# EAGLE schematic Vocodec_rev2_2 (EAGLE 6.5.0)
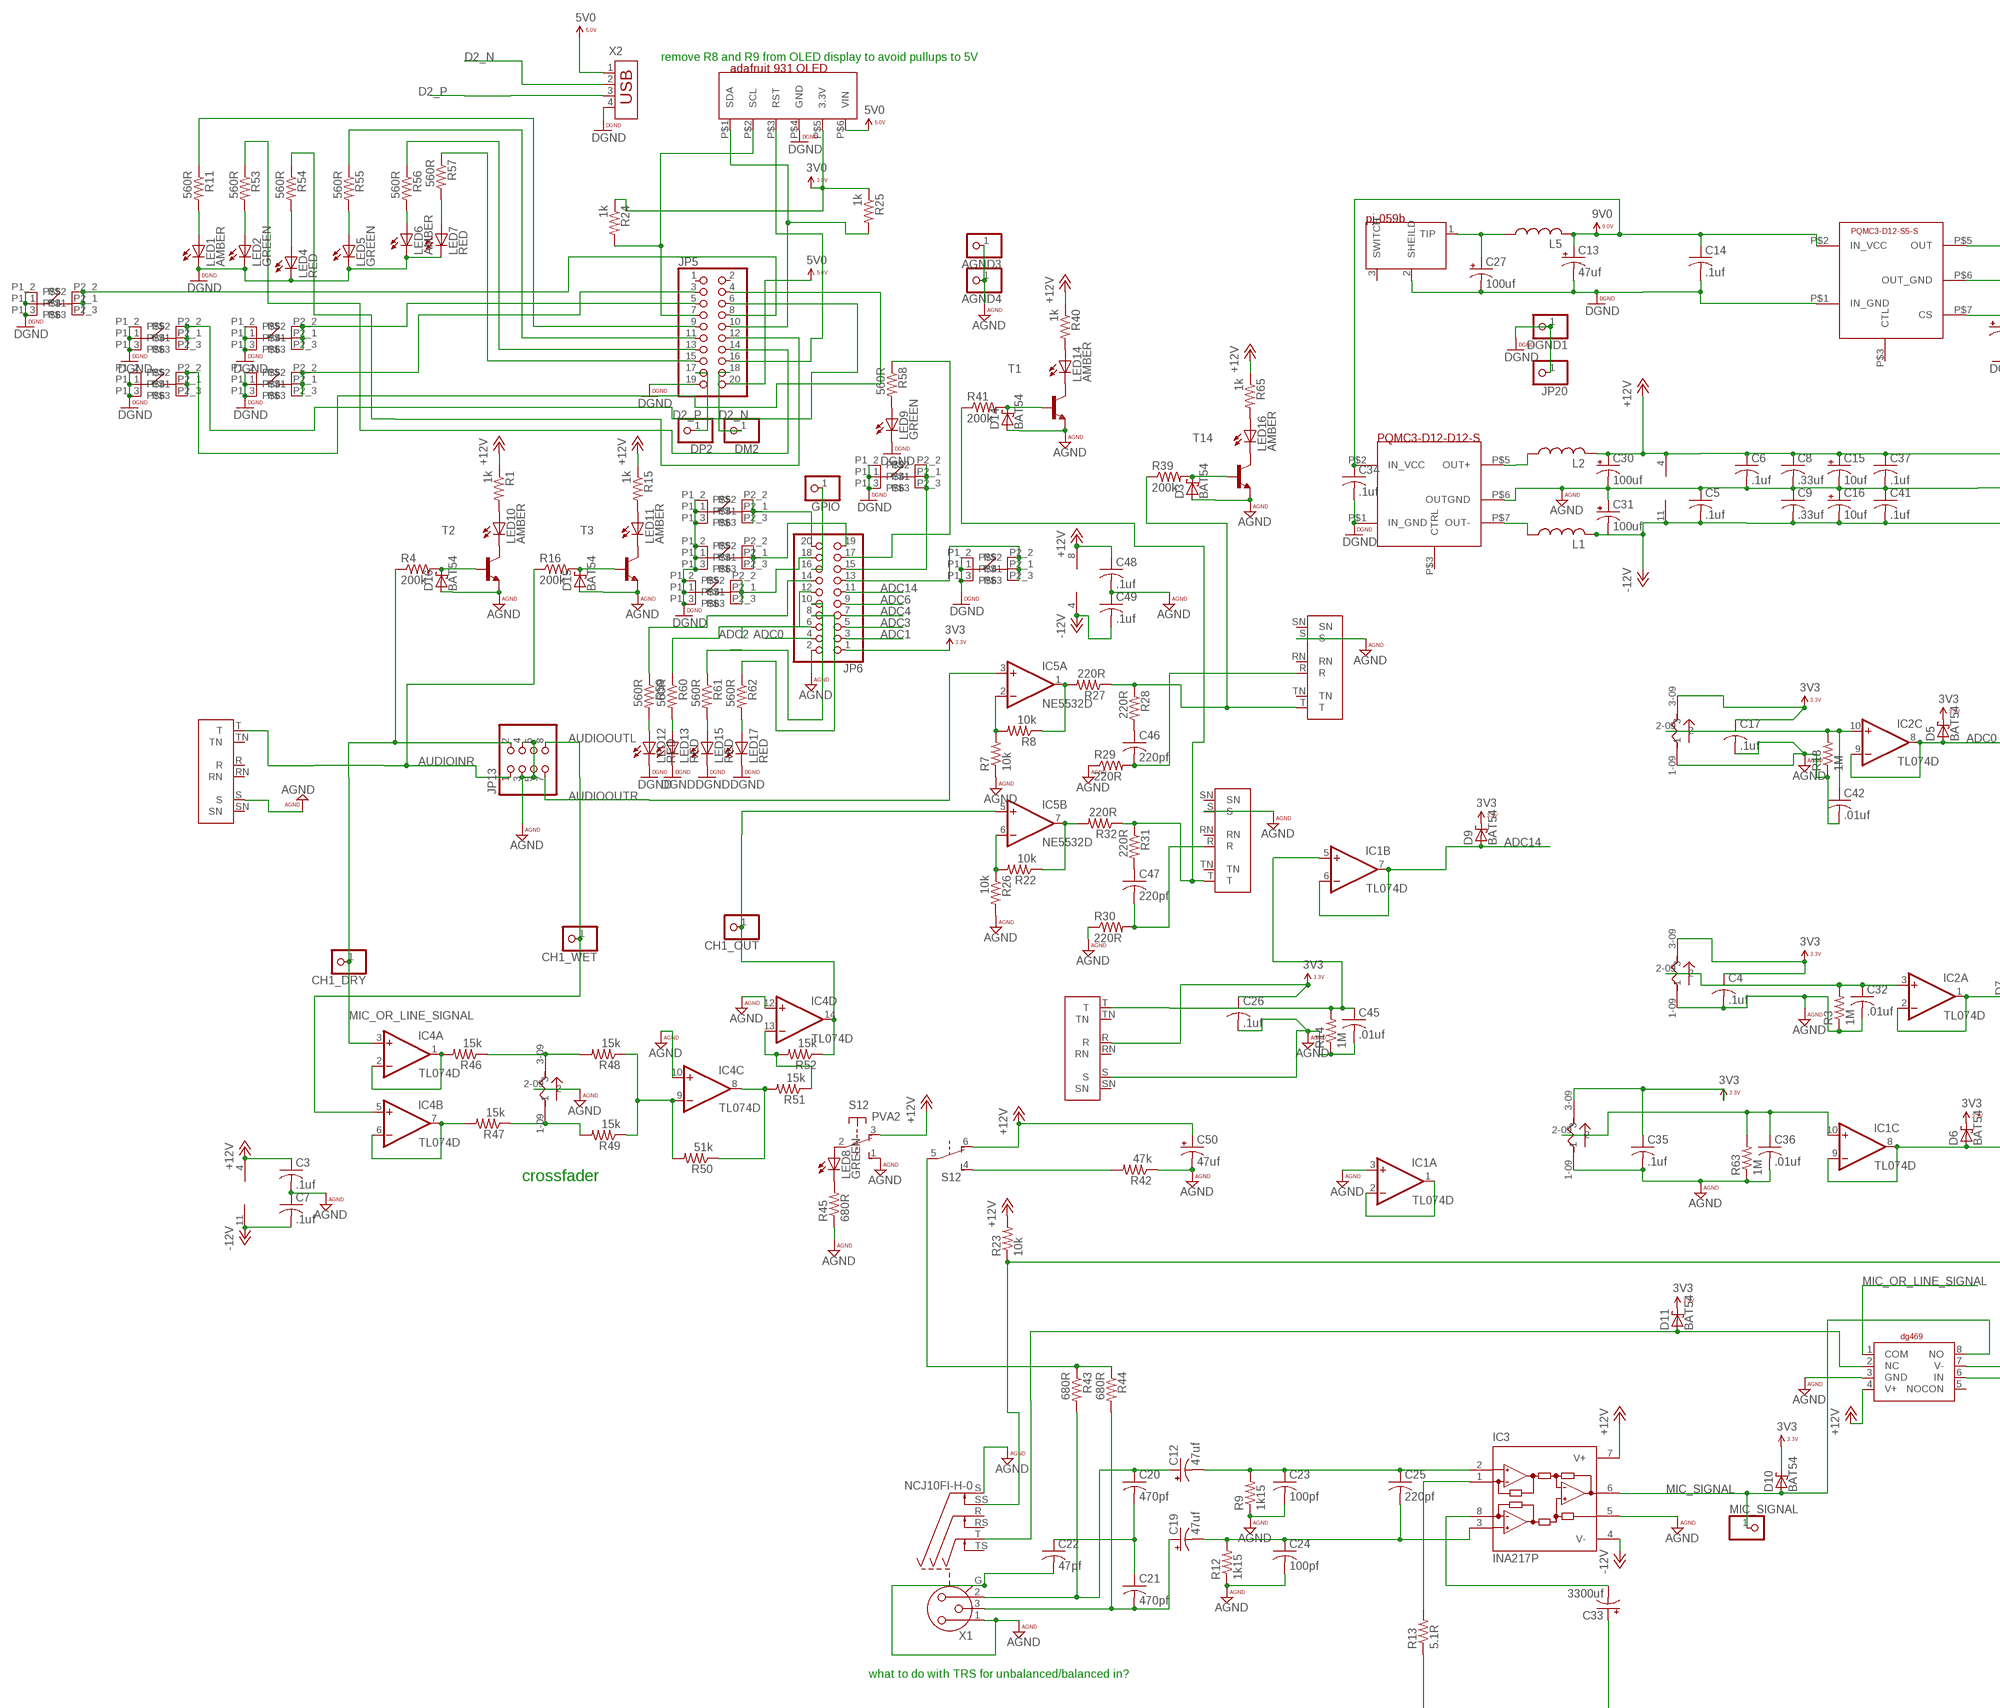
[diagram p0: schematic, sheet 1, part 1 of 3]
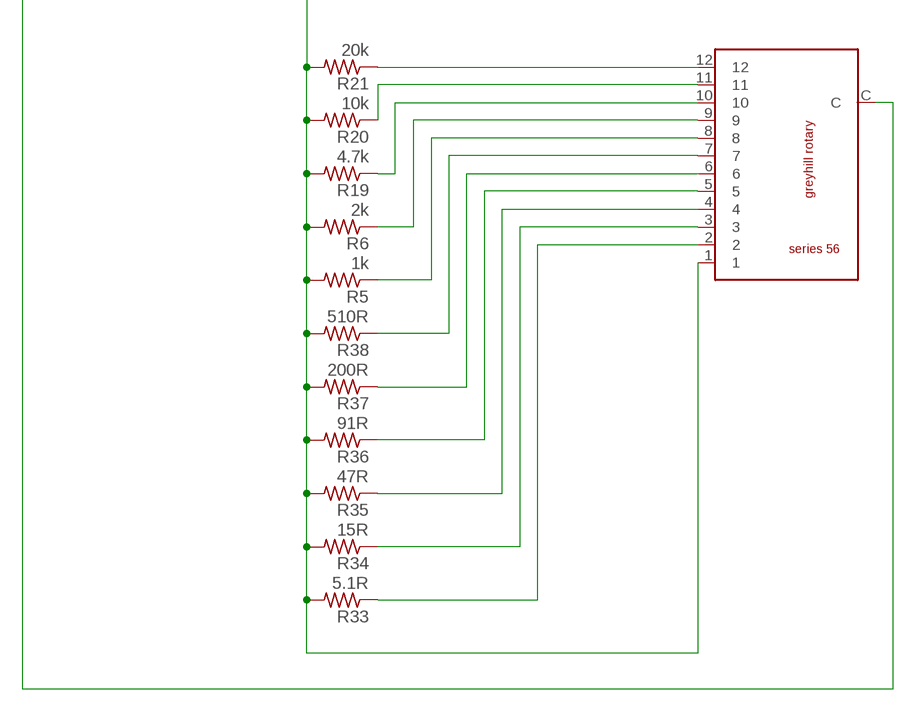
[diagram p1: schematic, sheet 1, part 2 of 3]
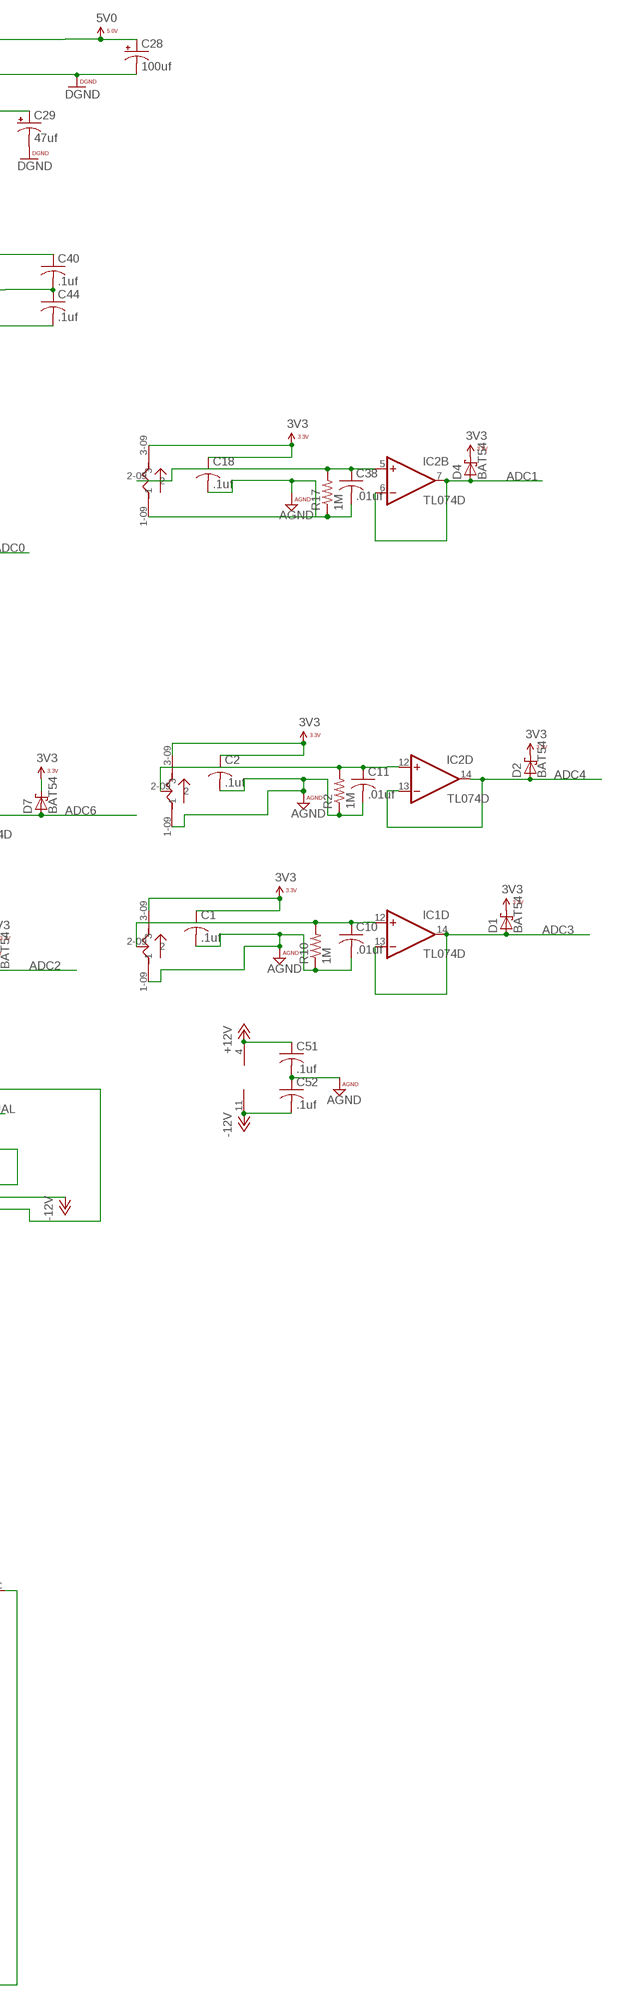
[diagram p2: schematic, sheet 1, part 3 of 3]

## Parts
AGND3  PINHD-1X1  [1X01]
AGND4  PINHD-1X1  [1X01]
C1  .1uf  C-USC0603  [C0603]
C2  .1uf  C-USC0603  [C0603]
C3  .1uf  C-USC0603  [C0603]
C4  .1uf  C-USC0603  [C0603]
C5  .1uf  C-USC0603  [C0603]
C6  .1uf  C-USC0603  [C0603]
C7  .1uf  C-USC0603  [C0603]
C8  .33uf  C-USC0603  [C0603]
C9  .33uf  C-USC0603  [C0603]
C10  .01uf  C-USC0603  [C0603]
C11  .01uf  C-USC0603  [C0603]
C12  47uf  CPOL-USE  [PANASONIC_E]
C13  47uf  CPOL-USE  [PANASONIC_E]
C14  .1uf  C-USC0603  [C0603]
C15  10uf  CPOL-USC  [PANASONIC_C]
C16  10uf  CPOL-USC  [PANASONIC_C]
C17  .1uf  C-USC0603  [C0603]
C18  .1uf  C-USC0603  [C0603]
C19  47uf  CPOL-USE  [PANASONIC_E]
C20  470pf  C-USC0603  [C0603]
C21  470pf  C-USC0603  [C0603]
C22  47pf  C-USC0603  [C0603]
C23  100pf  C-USC0603  [C0603]
C24  100pf  C-USC0603  [C0603]
C25  220pf  C-USC0603  [C0603]
C26  .1uf  C-USC0603  [C0603]
C27  100uf  CPOL-USF  [PANASONIC_F]
C28  100uf  CPOL-USF  [PANASONIC_F]
C29  47uf  CPOL-USE  [PANASONIC_E]
C30  100uf  CPOL-USF  [PANASONIC_F]
C31  100uf  CPOL-USF  [PANASONIC_F]
C32  .01uf  C-USC0603  [C0603]
C33  3300uf  CPOL-USE5-13  [E5-13]
C34  .1uf  C-USC0603  [C0603]
C35  .1uf  C-USC0603  [C0603]
C36  .01uf  C-USC0603  [C0603]
C37  .1uf  C-USC0603  [C0603]
C38  .01uf  C-USC0603  [C0603]
C40  .1uf  C-USC0603  [C0603]
C41  .1uf  C-USC0603  [C0603]
C42  .01uf  C-USC0603  [C0603]
C44  .1uf  C-USC0603  [C0603]
C45  .01uf  C-USC0603  [C0603]
C46  220pf  C-USC0603  [C0603]
C47  220pf  C-USC0603  [C0603]
C48  .1uf  C-USC0603  [C0603]
C49  .1uf  C-USC0603  [C0603]
C50  47uf  CPOL-USE  [PANASONIC_E]
C51  .1uf  C-USC0603  [C0603]
C52  .1uf  C-USC0603  [C0603]
CH1_DRY  PINHD-1X1  [1X01]
CH1_OUT  PINHD-1X1  [1X01]
CH1_WET  PINHD-1X1  [1X01]
D1  BAT54  [SOT23]
D2  BAT54  [SOT23]
D3  BAT54  [SOT23]
D4  BAT54  [SOT23]
D5  BAT54  [SOT23]
D6  BAT54  [SOT23]
D7  BAT54  [SOT23]
D9  BAT54  [SOT23]
D10  BAT54  [SOT23]
D11  BAT54  [SOT23]
D14  BAT54  [SOT23]
D15  BAT54  [SOT23]
D16  BAT54  [SOT23]
DGND1  PINHD-1X1  [1X01]
DM2  PINHD-1X1  [1X01]
DP2  PINHD-1X1  [1X01]
GPIO  PINHD-1X1  [1X01]
IC1  TL074D  [SO14]
IC2  TL074D  [SO14]
IC3  INA217P  [DIL08]
IC4  TL074D  [SO14]
IC5  NE5532D  [SO08]
IC11  PQMC3-D12-D12-S  [PQMC3-D12-D12-S]
IC12  PQMC3-D12-S5-S  [PQMC3-D12-D12-S]
IC13  DG469  [SO8]
J1  NRJ6HF2  [NRJ6HF2]
J3  NRJ6HF2  [NRJ6HF2]
J4  NRJ6HF2  [NRJ6HF2]
J9  NRJ6HF2  [NRJ6HF2]
J10  PJ-059B  [PJ-059B]
JP5  PINHD-2X10  [2X10]
JP6  PINHD-2X10  [2X10]
JP13  PINHD-2X4  [2X04]
JP20  PINHD-1X1  [1X01]
L1  L-US6000-XXX-RC  [6000-XXXX-RC]
L2  L-US6000-XXX-RC  [6000-XXXX-RC]
L5  L-US6000-XXX-RC  [6000-XXXX-RC]
LED1  AMBER  LG_T679-E1F1-1  [PLCC2]
LED2  GREEN  LG_T679-E1F1-1  [PLCC2]
LED4  RED  LG_T679-E1F1-1  [PLCC2]
LED5  GREEN  LG_T679-E1F1-1  [PLCC2]
LED6  AMBER  LG_T679-E1F1-1  [PLCC2]
LED7  RED  LG_T679-E1F1-1  [PLCC2]
LED8  GREEN  LG_T679-E1F1-1  [PLCC2]
LED9  GREEN  LG_T679-E1F1-1  [PLCC2]
LED10  AMBER  LG_T679-E1F1-1  [PLCC2]
LED11  AMBER  LG_T679-E1F1-1  [PLCC2]
LED12  RED  LG_T679-E1F1-1  [PLCC2]
LED13  RED  LG_T679-E1F1-1  [PLCC2]
LED14  AMBER  LG_T679-E1F1-1  [PLCC2]
LED15  RED  LG_T679-E1F1-1  [PLCC2]
LED16  AMBER  LG_T679-E1F1-1  [PLCC2]
LED17  RED  LG_T679-E1F1-1  [PLCC2]
MIC_SIGNAL  PINHD-1X1  [1X01]
OLED1  ADAFRUIT_931_OLED_128X32  [ADAFRUIT_128X32_OLED]
R1  1k  R-US_R0603  [R0603]
R2  1M  R-US_R0603  [R0603]
R3  1M  R-US_R0603  [R0603]
R4  200k  R-US_R0603  [R0603]
R5  1k  R-US_R0603  [R0603]
R6  2k  R-US_R0603  [R0603]
R7  10k  R-US_R0603  [R0603]
R8  10k  R-US_R0603  [R0603]
R9  1k15  R-US_R0603  [R0603]
R10  1M  R-US_R0603  [R0603]
R11  560R  R-US_R0603  [R0603]
R12  1k15  R-US_R0603  [R0603]
R13  5.1R  R-US_R0603  [R0603]
R14  1M  R-US_R0603  [R0603]
R15  1k  R-US_R0603  [R0603]
R16  200k  R-US_R0603  [R0603]
R17  1M  R-US_R0603  [R0603]
R18  1M  R-US_R0603  [R0603]
R19  4.7k  R-US_R0603  [R0603]
R20  10k  R-US_R0603  [R0603]
R21  20k  R-US_R0603  [R0603]
R22  10k  R-US_R0603  [R0603]
R23  10k  R-US_R0603  [R0603]
R24  1k  R-US_R0603  [R0603]
R25  1k  R-US_R0603  [R0603]
R26  10k  R-US_R0603  [R0603]
R27  220R  R-US_R0603  [R0603]
R28  220R  R-US_R0603  [R0603]
R29  220R  R-US_R0603  [R0603]
R30  220R  R-US_R0603  [R0603]
R31  220R  R-US_R0603  [R0603]
R32  220R  R-US_R0603  [R0603]
R33  5.1R  R-US_R0603  [R0603]
R34  15R  R-US_R0603  [R0603]
R35  47R  R-US_R0603  [R0603]
R36  91R  R-US_R0603  [R0603]
R37  200R  R-US_R0603  [R0603]
R38  510R  R-US_R0603  [R0603]
R39  200k  R-US_R0603  [R0603]
R40  1k  R-US_R0603  [R0603]
R41  200k  R-US_R0603  [R0603]
R42  47k  R-US_R0603  [R0603]
R43  680R  R-US_R0603  [R0603]
R44  680R  R-US_R0603  [R0603]
R45  680R  R-US_R0603  [R0603]
R46  15k  R-US_R0603  [R0603]
R47  15k  R-US_R0603  [R0603]
R48  15k  R-US_R0603  [R0603]
R49  15k  R-US_R0603  [R0603]
R50  51k  R-US_R0603  [R0603]
R51  15k  R-US_R0603  [R0603]
R52  15k  R-US_R0603  [R0603]
R53  560R  R-US_R0603  [R0603]
R54  560R  R-US_R0603  [R0603]
R55  560R  R-US_R0603  [R0603]
R56  560R  R-US_R0603  [R0603]
R57  560R  R-US_R0603  [R0603]
R58  560R  R-US_R0603  [R0603]
R59  560R  R-US_R0603  [R0603]
R60  560R  R-US_R0603  [R0603]
R61  560R  R-US_R0603  [R0603]
R62  560R  R-US_R0603  [R0603]
R63  1M  R-US_R0603  [R0603]
R65  1k  R-US_R0603  [R0603]
S12  PVA2  [PVA2F]
T1  MMBT3904LT1-NPN-SOT23-BEC  [SOT23-BEC]
T2  MMBT3904LT1-NPN-SOT23-BEC  [SOT23-BEC]
T3  MMBT3904LT1-NPN-SOT23-BEC  [SOT23-BEC]
T14  MMBT3904LT1-NPN-SOT23-BEC  [SOT23-BEC]
U$1  56DP30  [56DP30]
U$7  TL52_PLUS  [TL52_PLUS]
U$11  TL52_PLUS  [TL52_PLUS]
U$12  RK09  [RK09]
U$14  RK09  [RK09]
U$16  RK09  [RK09]
U$27  RK09  [RK09]
U$28  RK09  [RK09]
U$31  RK09  [RK09]
U$32  RK09  [RK09]
U$33  TL52_PLUS  [TL52_PLUS]
U$39  TL52_PLUS  [TL52_PLUS]
U$40  TL52_PLUS  [TL52_PLUS]
U$42  TL52_PLUS  [TL52_PLUS]
U$43  TL52_PLUS  [TL52_PLUS]
U$44  TL52_PLUS  [TL52_PLUS]
U$45  TL52_PLUS  [TL52_PLUS]
U$48  TL52_PLUS  [TL52_PLUS]
X1  NCJ10FI-H-0  [NCJ10FI-H-0]
X2  USB-787616  [USB]

## Nets
3V0: OLED1.P$5(3.3V) R24.1 R25.1
3V3: C1.1 C2.1 C4.1 C17.1 C18.1 C26.1 C35.1 D1.3(C) D2.3(C) D4.3(C) D5.3(C) D6.3(C) D7.3(C) D9.3(C) D10.3(C) D11.3(C) J9.R JP6.1 U$12.3-09 U$16.3-09 U$27.3-09 U$28.3-09 U$31.3-09 U$32.3-09
5V0: C28.+ IC12.P$5(OUT) JP5.20 OLED1.P$6(VIN) X2.1
9V0: C13.+ C14.1 C34.1 IC11.P$2(IN_VCC) IC12.P$2(IN_VCC) L5.2
+12V: C3.1 C6.1 C8.1 C15.+ C30.+ C37.1 C40.1 C48.1 C50.+ C51.1 IC1.4(P:V+) IC2.4(P:V+) IC3.7(V+) IC4.4(P:V+) IC5.8(P:V+) IC13.4(V+) L2.2 R1.1 R15.1 R23.2 R40.1 R65.1 S12.3(1:O) S12.6(2:O)
-12V: C5.2 C7.2 C9.2 C16.- C31.- C41.2 C44.2 C49.2 C52.2 IC1.11(P:V-) IC2.11(P:V-) IC3.4(V-) IC4.11(P:V-) IC5.4(P:V-) IC13.7(V-) L1.2
ADC0: D5.1(A) IC2.8(C:OUT) IC2.9(C:-IN) JP6.4
ADC1: D4.1(A) IC2.6(B:-IN) IC2.7(B:OUT) JP6.3
ADC2: D6.1(A) IC1.8(C:OUT) IC1.9(C:-IN) JP6.6
ADC3: D1.1(A) IC1.13(D:-IN) IC1.14(D:OUT) JP6.5
ADC4: D2.1(A) IC2.13(D:-IN) IC2.14(D:OUT) JP6.7
ADC6: D7.1(A) IC2.1(A:OUT) IC2.2(A:-IN) JP6.9
ADC14: D9.1(A) IC1.6(B:-IN) IC1.7(B:OUT) JP6.11
AGND: AGND3.1 AGND4.1 C1.2 C2.2 C3.2 C4.2 C5.1 C6.2 C7.1 C8.2 C9.1 C10.2 C11.2 C15.- C16.+ C17.2 C18.2 C22.2 C23.2 C24.2 C26.2 C30.- C31.+ C32.2 C35.2 C36.2 C37.2 C38.2 C40.2 C41.1 C42.2 C44.1 C45.2 C48.2 C49.1 C50.- C51.2 C52.1 D3.1(A) D14.1(A) D15.1(A) D16.1(A) IC1.3(A:+IN) IC3.5(REF) IC4.10(C:+IN) IC4.12(D:+IN) IC11.P$6(OUTGND) IC13.3(GND) J1.S J3.S J4.S J9.S JP6.2 JP13.3 JP13.4 JP13.5 JP13.6 R2.1 R3.1 R7.1 R9.1 R10.1 R12.1 R14.1 R17.1 R18.1 R26.2 R29.1 R30.1 R42.1 R45.1 R63.1 S12.1(1:S) T1.E T2.E T3.E T14.E U$12.1-09 U$14.2-09 U$16.1-09 U$27.1-09 U$28.1-09 U$31.1-09 U$32.1-09 X1.1 X1.G X1.S
AUDIOINR: J1.T JP13.1 R16.1
AUDIOOUTL: CH1_WET.1 IC4.5(B:+IN) JP13.8
AUDIOOUTR: IC5.3(A:+IN) JP13.7
D2_N: DM2.1 JP5.18 X2.2
D2_P: DP2.1 JP5.17 X2.3
DGND: C13.- C14.2 C27.- C28.- C29.- C34.2 DGND1.1 IC11.P$1(IN_GND) IC12.P$1(IN_GND) IC12.P$6(OUT_GND) J10.2(SHEILD) JP5.19 JP20.1 LED1.C LED2.C LED4.C LED5.C LED6.C LED7.C LED9.C LED12.C LED13.C LED15.C LED17.C OLED1.P$4(GND) U$7.P1_1 U$7.P1_2 U$7.P1_3 U$11.P1_1 U$11.P1_2 U$11.P1_3 U$33.P1_1 U$33.P1_2 U$33.P1_3 U$39.P1_1 U$39.P1_2 U$39.P1_3 U$40.P1_1 U$40.P1_2 U$40.P1_3 U$42.P1_1 U$42.P1_2 U$42.P1_3 U$43.P1_1 U$43.P1_2 U$43.P1_3 U$44.P1_1 U$44.P1_2 U$44.P1_3 U$45.P1_1 U$45.P1_2 U$45.P1_3 U$48.P1_1 U$48.P1_2 U$48.P1_3 X2.4
MIC_OR_LINE_SIGNAL: CH1_DRY.1 IC4.3(A:+IN) IC13.1(COM) JP13.2 R4.1
MIC_SIGNAL: D10.1(A) IC3.6(OUT) IC13.8(NO) MIC_SIGNAL.1
N$1: IC5.2(A:-IN) R7.2 R8.2
N$2: IC5.6(B:-IN) R22.2 R26.1
N$3: LED10.C T2.C
N$4: IC5.1(A:OUT) R8.1 R27.2
N$5: LED10.A R1.2
N$6: IC1.1(A:OUT) IC1.2(A:-IN)
N$7: LED11.C T3.C
N$8: D16.3(C) R4.2 T2.B
N$9: IC5.7(B:OUT) R22.1 R32.2
N$10: IC13.6(IN) R23.1 X1.SS
N$11: LED11.A R15.2
N$12: C33.+ R5.2 R6.2 R19.2 R20.2 R21.2 R33.2 R34.2 R35.2 R36.2 R37.2 R38.2 U$1.1
N$13: D15.3(C) R16.2 T3.B
N$14: IC11.P$5(OUT+) L2.1
N$15: IC11.P$7(OUT-) L1.1
N$16: LED14.C T1.C
N$17: LED14.A R40.2
N$18: JP6.19 U$45.P2_1 U$45.P2_2 U$45.P2_3
N$19: R21.1 U$1.12
N$20: R20.1 U$1.11
N$21: C12.- C23.1 C25.1 IC3.2(-IN) R9.2
N$22: C19.+ C21.2 R44.2 X1.3
N$23: C12.+ C20.1 R43.2 X1.2
N$24: C20.2 C21.1 C22.1
N$25: LED16.C T14.C
N$26: LED16.A R65.2
N$27: R19.1 U$1.10
N$28: R6.1 U$1.9
N$29: C19.- C24.1 C25.2 IC3.3(+IN) R12.2
N$30: LED8.A S12.2(1:P)
N$31: IC3.1(RG1) R13.2
N$32: D11.1(A) IC13.2(NC) X1.T
N$33: R5.1 U$1.8
N$34: R38.1 U$1.7
N$35: R13.1 U$1.C
N$36: R37.1 U$1.6
N$37: R36.1 U$1.5
N$38: R35.1 U$1.4
N$39: R34.1 U$1.3
N$40: R33.1 U$1.2
N$41: J3.T R27.1 R28.1 R39.1
N$42: C46.2 J3.R R29.2
N$43: R42.2 S12.4(2:S)
N$44: C47.2 J4.R R30.2
N$45: D3.3(C) R39.2 T14.B
N$46: C46.1 R28.2
N$47: C47.1 R31.2
N$48: J4.T R31.1 R32.1 R41.1
N$49: LED8.C R45.2
N$50: C27.+ J10.1(TIP) L5.1
N$51: IC4.1(A:OUT) IC4.2(A:-IN) R46.2
N$52: D14.3(C) R41.2 T1.B
N$53: C29.+ IC12.P$7(CS)
N$54: R43.1 R44.1 S12.5(2:P)
N$55: IC4.6(B:-IN) IC4.7(B:OUT) R47.2
N$56: R46.1 R48.2 U$14.3-09
N$57: C36.1 IC1.10(C:+IN) R63.2 U$16.2-09
N$58: IC4.8(C:OUT) R50.1 R51.2
N$59: IC4.9(C:-IN) R48.1 R49.1 R50.2
N$60: IC4.13(D:-IN) R51.1 R52.2
N$62: LED1.A R11.2
N$63: LED2.A R53.2
N$64: CH1_OUT.1 IC4.14(D:OUT) IC5.5(B:+IN) R52.1
N$65: LED4.A R54.2
N$66: LED5.A R55.2
N$67: JP6.18 U$48.P2_1 U$48.P2_2 U$48.P2_3
N$68: C33.- IC3.8(RG2)
N$69: LED9.A R58.2
N$70: JP6.17 R58.1
N$71: LED6.A R56.2
N$72: LED7.A R57.2
N$73: JP6.15 U$43.P2_1 U$43.P2_2 U$43.P2_3
N$74: JP6.13 U$42.P2_1 U$42.P2_2 U$42.P2_3
N$75: LED12.A R59.2
N$76: LED13.A R60.2
N$77: JP6.20 U$44.P2_1 U$44.P2_2 U$44.P2_3
N$78: LED15.A R61.2
N$79: LED17.A R62.2
N$80: JP6.14 R59.1
N$81: JP6.12 R60.1
N$82: JP6.10 R61.1
N$83: JP6.8 R62.1
N$84: GPIO.1 JP6.16
N$85: R47.1 R49.2 U$14.1-09
PA8: JP5.13 R56.1
PA9: JP5.16 OLED1.P$3(RST)
PA10: JP5.15 R57.1
PB12: JP5.4 U$39.P2_1 U$39.P2_2 U$39.P2_3
PB13: JP5.3 U$7.P2_1 U$7.P2_2 U$7.P2_3
PB14: JP5.6 U$33.P2_1 U$33.P2_2 U$33.P2_3
PB15: JP5.5 U$11.P2_1 U$11.P2_2 U$11.P2_3
PC6: JP5.9 R11.1
PC7: JP5.12 R54.1
PC8: JP5.11 R55.1
PC9: JP5.14 R53.1
PD11_NOTIMER: JP5.8 U$40.P2_1 U$40.P2_2 U$40.P2_3
POT1: C10.1 IC1.12(D:+IN) R10.2 U$12.2-09
POT3: C32.1 IC2.3(A:+IN) R3.2 U$32.2-09
POT4: C11.1 IC2.12(D:+IN) R2.2 U$31.2-09
POT7: C38.1 IC2.5(B:+IN) R17.2 U$28.2-09
POT8: C42.1 IC2.10(C:+IN) R18.2 U$27.2-09
POT9: C45.1 IC1.5(B:+IN) J9.T R14.2
SCL: JP5.7 OLED1.P$2(SCL) R24.2
SDA: JP5.10 OLED1.P$1(SDA) R25.2
Unconnected: IC11.P$3(CTRL) IC12.P$3(CTL) IC13.5(NOCON) J1.R J1.RN J1.SN J1.TN J3.RN J3.SN J3.TN J4.RN J4.SN J4.TN J9.RN J9.SN J9.TN J10.3(SWITCH) JP5.1 JP5.2 X1.R X1.RS X1.TS

## Notes on the sheet
- remove R8 and R9 from OLED display to avoid pullups to 5V
- crossfader
- what to do with TRS for unbalanced/balanced in?

## Library data of the parts
AGND3 AGND4 CH1_DRY CH1_OUT CH1_WET DGND1 DM2 DP2 GPIO JP20 MIC_SIGNAL = adafruit:PINHD-1X1: Pin header 1x1 for 0.1" spacing With round pins; PARTNO: *DNP
C1-C7 C14 C17 C18 C26 C34 C35 C37 C40 C41 C44 C48 C49 C51 C52 = rcl:C-US: CAPACITOR, American symbol; PARTNO: CC0603KRX7R8BB104
C8 C9 = rcl:C-US: CAPACITOR, American symbol; PARTNO: C1608X7R1H334K080AC
C10 C11 C32 C36 C38 C42 C45 = rcl:C-US: CAPACITOR, American symbol; PARTNO: CC0603KRX7R8BB103
C12 C13 C19 C29 C50 = adafruit:CPOL-US: POLARIZED CAPACITOR, American symbol; PARTNO: EEE-1VA470AP
C15 C16 = adafruit:CPOL-US: POLARIZED CAPACITOR, American symbol; PARTNO: EEE-1VA100AR
C20 C21 = rcl:C-US: CAPACITOR, American symbol; PARTNO: CC0603JRNPO9BN471
C22 = rcl:C-US: CAPACITOR, American symbol; PARTNO: C0603C470J5GACTU
C23 C24 = rcl:C-US: CAPACITOR, American symbol; PARTNO: C0603C101J3GACTU
C25 C46 C47 = rcl:C-US: CAPACITOR, American symbol; PARTNO: CC0603JRNPO9BN221
C27 C28 C30 C31 = adafruit:CPOL-US: POLARIZED CAPACITOR, American symbol; PARTNO: EEE-1EA101P
C33 = adafruit:CPOL-US: POLARIZED CAPACITOR, American symbol; PARTNO: EEU-FR1A332
D1-D7 D9-D11 D14-D16 = diode:BAT54: Schottky Diodes Source: Fairchild .. BAT54.pdf; PARTNO: BAT54
IC1 IC2 IC4 = linear:TL074: OP AMP; PARTNO: TL074CDR
IC3 = burr-brown:INA217: Low-Noise, Low-Distortion INSTRUMENTATION AMPLIFIER Replacement for SSM2017 Source: http://focus.ti.com/lit/ds/symlink/ina217.pdf; MF: TEXAS INSTRUMENTS; MPN: INA217AIP; OC_FARNELL: 1212423; OC_NEWARK: 74C9859; PARTNO: *DNP
IC5 = linear:NE5532: AUDIO AMPLIFIER; PARTNO: NE5532DR
IC11 = custom:PQMC3-D12-D12-S; PARTNO: PQMC3-D12-D12-S
IC12 = custom:PQMC3-D12-S5-S; PARTNO: PQMC3-D12-S5-S
IC13 = custom:DG469; PARTNO: DG469EY-T1-E3
J1 J3 J4 J9 = custom:NRJ6HF2; PARTNO: NRJ6HM-1
J10 = custom:PJ-059B; PARTNO: PJ-059A
JP5 JP6 = SparkFun-Connectors:PINHD-2X10: PIN HEADER; PARTNO: PRPC010DAAN-RC
JP13 = adafruit:PINHD-2X4: PIN HEADER; PARTNO: PRPC004DAAN-RC
L1 L2 L5 = rcl:L-US: INDUCTOR, American symbol; PARTNO: RLB9012-100KL
LED1 LED6 LED10 LED11 LED14 LED16 = led:*_T679-?-1: LC TOPLED® Low Current LED Source: http://catalog.osram-os.com .. LG_LS_LY_T679_OBS.pdf; COLOR: green; PARTNO: HSMU-A100-S00J1
LED2 LED5 LED8 LED9 = led:*_T679-?-1: LC TOPLED® Low Current LED Source: http://catalog.osram-os.com .. LG_LS_LY_T679_OBS.pdf; COLOR: green; PARTNO: HSMM-A101-R00J1
LED4 LED7 LED12 LED13 LED15 LED17 = led:*_T679-?-1: LC TOPLED® Low Current LED Source: http://catalog.osram-os.com .. LG_LS_LY_T679_OBS.pdf; COLOR: green; PARTNO: HSMZ-A100-R00J1
OLED1 = custom:ADAFRUIT_931_OLED_128X32; PARTNO: 931
R1 R5 R15 R24 R25 R40 R65 = resistor:R-US_: RESISTOR, American symbol; PARTNO: ESR03EZPF1001
R2 R3 R10 R14 R17 R18 R63 = resistor:R-US_: RESISTOR, American symbol; PARTNO: CRCW06031M00FKEAHP
R4 R16 R39 R41 = resistor:R-US_: RESISTOR, American symbol; PARTNO: ESR03EZPJ204
R6 = resistor:R-US_: RESISTOR, American symbol; PARTNO: ERJ-PA3F2001V
R7 R8 R20 R22 R23 R26 = resistor:R-US_: RESISTOR, American symbol; PARTNO: ESR03EZPF1002
R9 R12 = resistor:R-US_: RESISTOR, American symbol; PARTNO: ERA-3AEB1151V
R11 R53-R62 = resistor:R-US_: RESISTOR, American symbol; PARTNO: ESR03EZPF5600
R13 R33 = resistor:R-US_: RESISTOR, American symbol; PARTNO: RC0603JR-075R1L
R19 = resistor:R-US_: RESISTOR, American symbol; PARTNO: CRCW06034K70FKEAHP
R21 = resistor:R-US_: RESISTOR, American symbol; PARTNO: ESR03EZPF2002
R27-R32 = resistor:R-US_: RESISTOR, American symbol; PARTNO: ESR03EZPJ221
R34 = resistor:R-US_: RESISTOR, American symbol; PARTNO: RC0603JR-0715RL
R35 = resistor:R-US_: RESISTOR, American symbol; PARTNO: RC0603JR-0747RL
R36 = resistor:R-US_: RESISTOR, American symbol; PARTNO: RC0603JR-0791RL
R37 = resistor:R-US_: RESISTOR, American symbol; PARTNO: RC0603JR-07200RL
R38 = resistor:R-US_: RESISTOR, American symbol; PARTNO: RC0603JR-07510RL
R42 = resistor:R-US_: RESISTOR, American symbol; PARTNO: ESR03EZPJ473
R43-R45 = resistor:R-US_: RESISTOR, American symbol; PARTNO: CRCW0603680RJNEAHP
R46-R49 R51 R52 = resistor:R-US_: RESISTOR, American symbol; PARTNO: ESR03EZPF1502
R50 = resistor:R-US_: RESISTOR, American symbol; PARTNO: ERJ-PA3F5102V
S12 = switch-misc:PVA2: ITT SWITCH; PARTNO: PVA2 OA H4 1.7N V2
T1-T3 T14 = transistor:*-NPN-: NPN Transistror BF959 corrected 2008.03.06; PARTNO: MMBT3904-TP
U$1 = custom:56DP30; PARTNO: 56DP30-01-1-AJN
U$7 U$11 U$33 U$39 U$40 U$42-U$45 U$48 = custom:TL52_PLUS; PARTNO: *DNP
U$12 U$14 U$16 U$27 U$28 U$31 U$32 = custom:RK09; PARTNO: *DNP
X1 = con-neutrik_ag:NCJ10FI-: Neutrik Audio Connector XLR SERIES Stereo 1/4" jack with switch Source: www.neutrik.com/; MPN: NCJ10FI-H-0; OC_FARNELL: unknown; OC_NEWARK: 99B1398; PARTNO: NCJ10FI-H-01
X2 = con-amp:USB-787616: AMP connector; PARTNO: 292303-1

## Net classes
1 POWER: width 0.813 mm, drill 0.559 mm, clearance 0.254 mm
3 +12V: width 0.61 mm, drill 0.483 mm, clearance 0.254 mm